# Altium schematic sheet power.SchDoc
size 420 x 297 mm; SheetNumber: 1; SheetTotal: 3
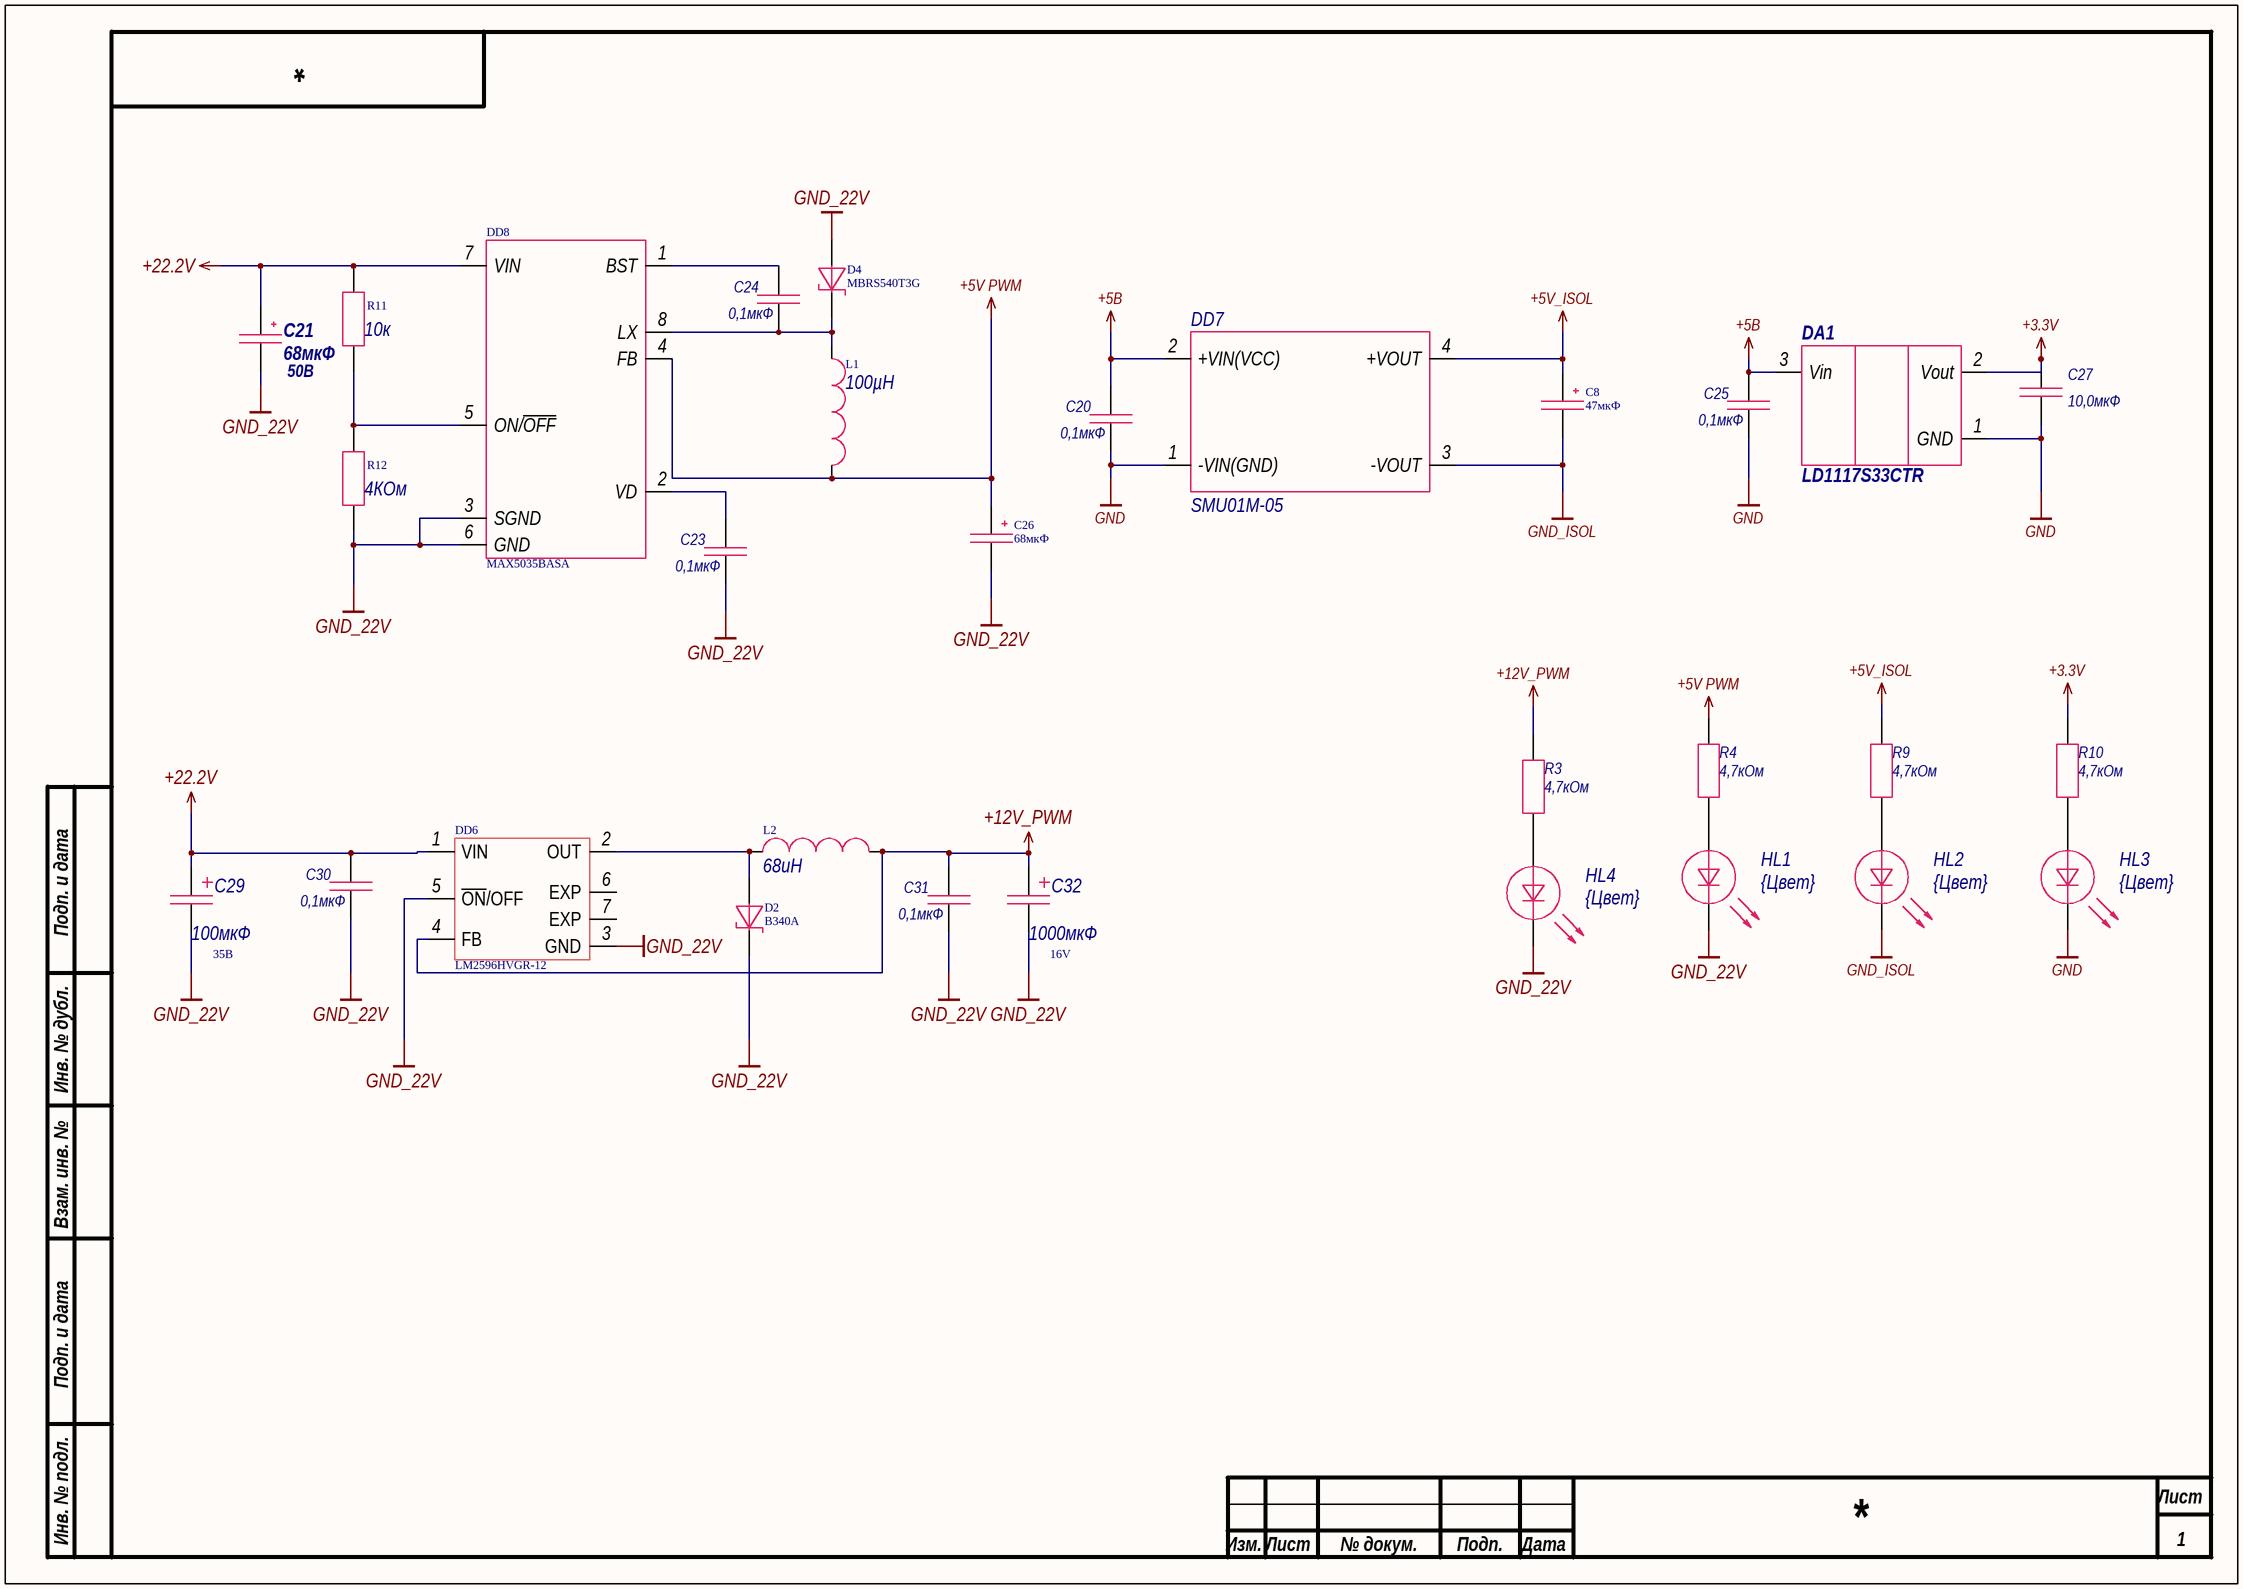
[diagram p0: power.SchDoc]

## Parts
C8  47мкФ  [TC_B (3528)]
C20  value 0,1мкФ  [0603C]  (hidden comment: Capacitor)
C21  value 68мкФ  Parameter 1: 50В  [CAPPR65-350-1150X800X1250]  (hidden comment: 100uF)
C23  value 0,1мкФ  [0603C]  (hidden comment: Capacitor)
C24  value 0,1мкФ  [0603C]  (hidden comment: Capacitor)
C25  value 0,1мкФ  [0603C]  (hidden comment: Capacitor)
C26  68мкФ  [TC_D (7343)]
C27  value 10,0мкФ  [0603C]  (hidden comment: Capacitor)
C29  value 100мкФ  Rate: 35В  [THD12.5.25]  (hidden comment: 1uF)
C30  value 0,1мкФ  [0603C]  (hidden comment: Capacitor)
C31  value 0,1мкФ  [0603C]  (hidden comment: Capacitor)
C32  value 1000мкФ  Rate: 16V  [THD12.5.25]  (hidden comment: 1uF)
D2  B340A  [DIOM4326X23M]
D4  MBRS540T3G  [ONSC-SMC-2-403-03_V]
DA1  value LD1117S33CTR  [SOT223]  (hidden comment: LD1117S33)
DD6  LM2596HVGR-12  [VREG_LM2596S-3.3]
DD7  SMU01M-05  [DC-DC 5-5]
DD8  MAX5035BASA  [S8+5_L]
HL1  Color: {Цвет}  [0805D]
HL2  Color: {Цвет}  [0805D]
HL3  Color: {Цвет}  [0805D]
HL4  Color: {Цвет}  [0805D]
L1  value 100µH  [IND_VLS4012CX_4X4_TDK]  (hidden comment: Inductance)
L2  value 68uH  [IND_LQH32CN680K53L]  (hidden comment: Inductance)
R3  value 4,7кОм  [0603R]  (hidden comment: Resistor)
R4  value 4,7кОм  [0603R]  (hidden comment: Resistor)
R9  value 4,7кОм  [0603R]  (hidden comment: Resistor)
R10  value 4,7кОм  [0603R]  (hidden comment: Resistor)
R11  value 10к  [0805R]  (hidden comment: Resistor)
R12  value 4КОм  [0805R]  (hidden comment: Resistor)

## Nets
+3.3V: C27.1 DA1.2(Vout) R10.1
+5V PWM: C26.1 DD8.4(FB) L1.2 R4.1
+5V_ISOL: C8.1 DD7.4(+VOUT) R9.1
+5В: C20.1 C25.1 DA1.3(Vin) DD7.2(+VIN(VCC))
+12V_PWM: C31.1 C32.1 DD6.4(FB) L2.2 R3.1
+22.2V: C21.1 C29.1 C30.1 DD6.1(VIN) DD8.7(VIN) R11.2
GND: C20.2 C25.2 C27.2 DA1.1(GND) DD7.1(-VIN(GND)) HL3.2
GND_22V: C21.2 C23.2 C26.2 C29.2 C30.2 C31.2 C32.2 D2.2 D4.1 DD6.3(GND) DD6.5(~{ON}/OFF) DD8.3(SGND) DD8.6(GND) HL1.2 HL4.2 R12.1
GND_ISOL: C8.2 DD7.3(-VOUT) HL2.2
NetC23_1: C23.1 DD8.2(VD)
NetC24_1: C24.1 DD8.1(BST)
NetC24_2: C24.2 D4.2 DD8.8(LX) L1.1
NetD2_1: D2.1 DD6.2(OUT) L2.1
NetDD8_5: DD8.5(ON/~{OFF}) R11.1 R12.2
NetHL1_1: HL1.1 R4.2
NetHL2_1: HL2.1 R9.2
NetHL3_1: HL3.1 R10.2
NetHL4_1: HL4.1 R3.2

Not connected (* = marked no-connect by the designer): DD6 6(EXP) 7(EXP)

## Notes on the sheet
- Подп. и дата
- Инв. № дубл.
- Взам. инв. №
- Инв. № подл.
- Лист
- Изм.
- № докум.
- Подп.
- Дата

## Library data of the parts
C8 C26 = Capacitor_pol: Value: {Номинал}; Shop: https://www.chipdip.ru/product/tecap-68-mkf-10-v-tip-d-10-2
C21 = Capacitor_pol_100uF: Shop: https://www.chipdip.ru/product0/9000565885
C29 C32 = Capacitor_pol
  C29: Shop: https://www.chipdip.ru/product0/9000261772
  C32: Shop: https://www.chipdip.ru/product0/8007171953
D2 = CMP-1055-00390-1: Schottky Power Rectifier, 2-Pin SMC, Pb-Free, Tape and Reel; Manufacturer: On Semiconductor; PartNumber: MBRS540T3G; IFSM Max (A): 190; Shop: https://www.chipdip.ru/product/b340a; ComponentLink1URL: http://www.onsemi.com/; ComponentLink3URL: http://www.onsemi.com/pub_link/Collateral/403-03.PDF; ComponentLink1Description: Manufacturer URL; PackageVersion: Rev. E, 08/2005; Packing: Tape and Reel; ComponentLink2URL: http://www.onsemi.cn/pub_link/Collateral/MBRS540T3-D.PDF; RoHS: TRUE; DatasheetVersion: Rev. 8; Mounting Technology: Surface Mount; ComponentLink3Description: Package Specification; ComponentLink2Description: Datasheet; PackageDescription: 2-Pin Small Molded Package, J-Bend Lead, Body 5.845 x 6.855 mm; PackageReference: SMC-2-403-03
D4 = CMP-1055-00390-1: Schottky Power Rectifier, 2-Pin SMC, Pb-Free, Tape and Reel; Manufacturer: On Semiconductor; Configuration: Single; IFSM Max (A): 190; ComponentLink1URL: http://www.onsemi.com/; ComponentLink3URL: http://www.onsemi.com/pub_link/Collateral/403-03.PDF; ComponentLink1Description: Manufacturer URL; PackageVersion: Rev. E, 08/2005; Packing: Tape and Reel; ComponentLink2URL: http://www.onsemi.cn/pub_link/Collateral/MBRS540T3-D.PDF; RoHS: TRUE; DatasheetVersion: Rev. 8; Mounting Technology: Surface Mount; ComponentLink3Description: Package Specification; ComponentLink2Description: Datasheet; PartNumber: MBRS540T3G; PackageDescription: 2-Pin Small Molded Package, J-Bend Lead, Body 5.845 x 6.855 mm; PackageReference: SMC-2-403-03
DA1 = LD1117S33: Manufacturer: ST Microelectronics; Notice: Стабилизатор напряжения 3,3В; Rate: 0...15В; Datasheet: https://lib.chipdip.ru/168/DOC001168686.pdf; Shop: https://www.chipdip.ru/product/ld1117v33; Case: SOT223
DD6 = LM2596HVGR-12: MF: Texas Instruments; MP: LM2596S-3.3; Shop: https://www.chipdip.ru/product/lm2596hvgr-12; SnapEDA_Link: https://www.snapeda.com/parts/LM2596S-3.3/Texas+Instruments/view-part/?ref=snap; Availability: In Stock; Value: *; Price: None; Package: TO-263-5 Texas Instruments; Purchase-URL: https://pricing.snapeda.com/search/part/LM2596S-3.3/?ref=eda
DD7 = SMU01L-05: DC/DC преобразователь, 1Вт, вход 4.5-5.5В, выход 5В/200мА; MP: TME_1212S; Value: *; Availability: Unavailable; Price: None; Package: None
DD8 = MAX5035BASA+T: 1A, 76V, High-Efficiency MAXPower Step-Down DC-DC Converter, 5V output, 8-Pin SOIC, -40°C to +125°C, Pb-Free; ComponentLink2Description: Datasheet; Code_IPC: SOIC127P600-8; PackageDescription: 8-Pin Small-Outline IC, Narrow (0.15in), 1.27 mm Pitch, SOIC (N), Pb-Free; ComponentLink1URL: http://www.maxim-ic.com; PackageVersion: revC, 2010; Code_JEDEC: MS-012-AA; ComponentLink3URL: http://pdfserv.maxim-ic.com/package_dwgs/21-0041.PDF; DatasheetVersion: Rev 5, May-2011; ComponentLink2URL: http://datasheets.maxim-ic.com/en/ds/MAX5035.pdf; PackageReference: S8+5; ComponentLink1Description: Manufacturer URL; ComponentLink3Description: Package Specification
HL1-HL4 = LED: Manufacturer: -; Rate: -; Datasheet: -; Shop: -; Notice: -; Case: -
L1 L2 = Inductance
  L2: Shop: https://www.chipdip.ru/product0/8009279023